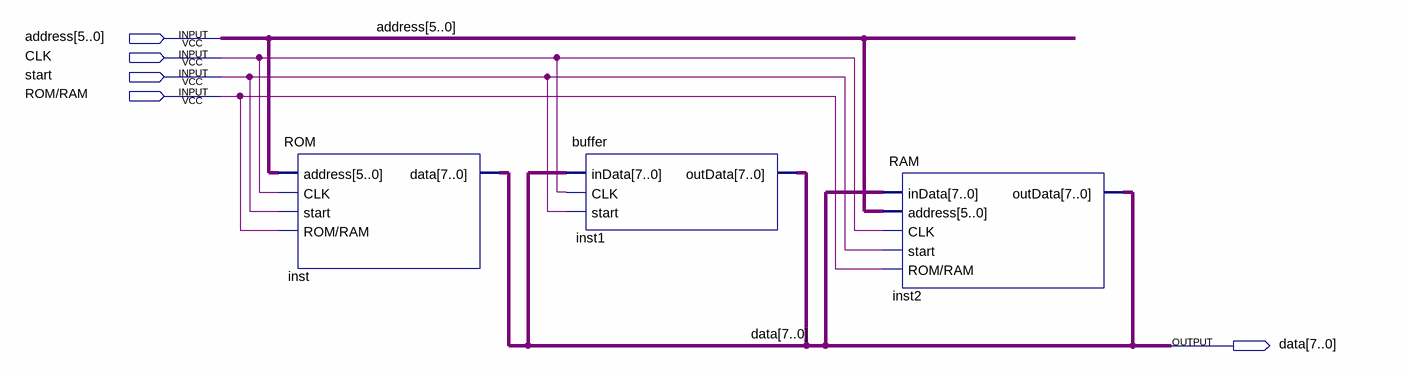
[diagram p0: schematic sheet]
// Quartus schematic Lab3.bdf as structural Verilog: 3 symbols, 5 pins
module Lab3 (
  input  [5:0] address,
  input  CLK,
  input  start,
  input  \ROM/RAM ,
  output [7:0] data
);

  ROM inst (.address(address), .CLK(CLK), .start(start), .\ROM/RAM (\ROM/RAM ), .data(data));
  buffer inst1 (.inData(data), .CLK(CLK), .start(start), .outData(data));
  RAM inst2 (.inData(data), .address(address), .CLK(CLK), .start(start), .\ROM/RAM (\ROM/RAM ), .outData(data));
endmodule
